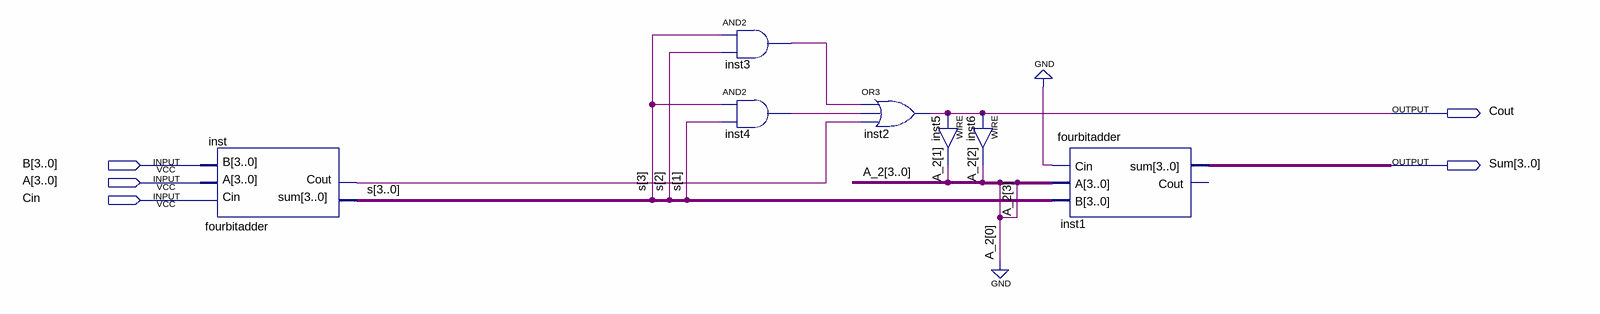
[diagram p0: schematic sheet]
// Quartus schematic SingleDigitBCDAdder.bdf as structural Verilog: 7 symbols, 5 pins
module SingleDigitBCDAdder (
  input  [3:0] B,
  input  [3:0] A,
  input  Cin,
  output Cout,
  output [3:0] Sum
);

  wire inst3_out, inst4_out, inst_cout;
  wire [2:1] A_2;
  wire [3:0] s;

  fourbitadder inst (.Cin(Cin), .A(A), .B(B), .sum(s), .Cout(inst_cout));
  and inst3 (inst3_out, s[3], s[2]);
  and inst4 (inst4_out, s[3], s[1]);
  or inst2 (Cout, inst3_out, inst4_out, inst_cout);
  assign A_2[1] = Cout;  // WIRE inst5
  assign A_2[2] = Cout;  // WIRE inst6
  fourbitadder inst1 (.Cin(1'b0), .A({1'b0, A_2, 1'b0}), .B(s), .sum(Sum));  // open: Cout
endmodule
